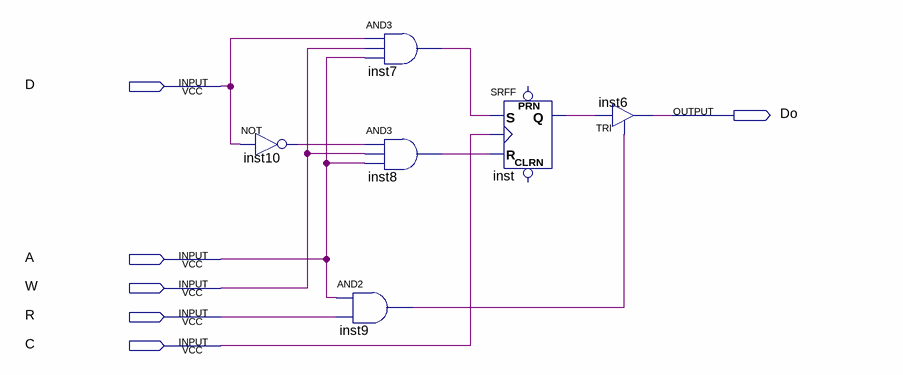
[diagram p0: schematic sheet]
// Quartus schematic RAM1x1.bdf as structural Verilog: 6 symbols, 6 pins
module RAM1x1 (
  input  D,
  input  A,
  input  W,
  input  R,
  input  C,
  output Do
);

  wire inst7_out, inst8_out, inst9_out, inst10_out, inst_q;

  not inst10 (inst10_out, D);
  and inst9 (inst9_out, A, R);
  and inst7 (inst7_out, D, W, A);
  and inst8 (inst8_out, inst10_out, W, A);
  SRFF inst (.S(inst7_out), .R(inst8_out), .CLK(C), .Q(inst_q));  // open: PRN, CLRN
  TRI inst6 (.IN(inst_q), .OE(inst9_out), .OUT(Do));
endmodule
